# EAGLE schematic tingle (EAGLE 8.3.1)
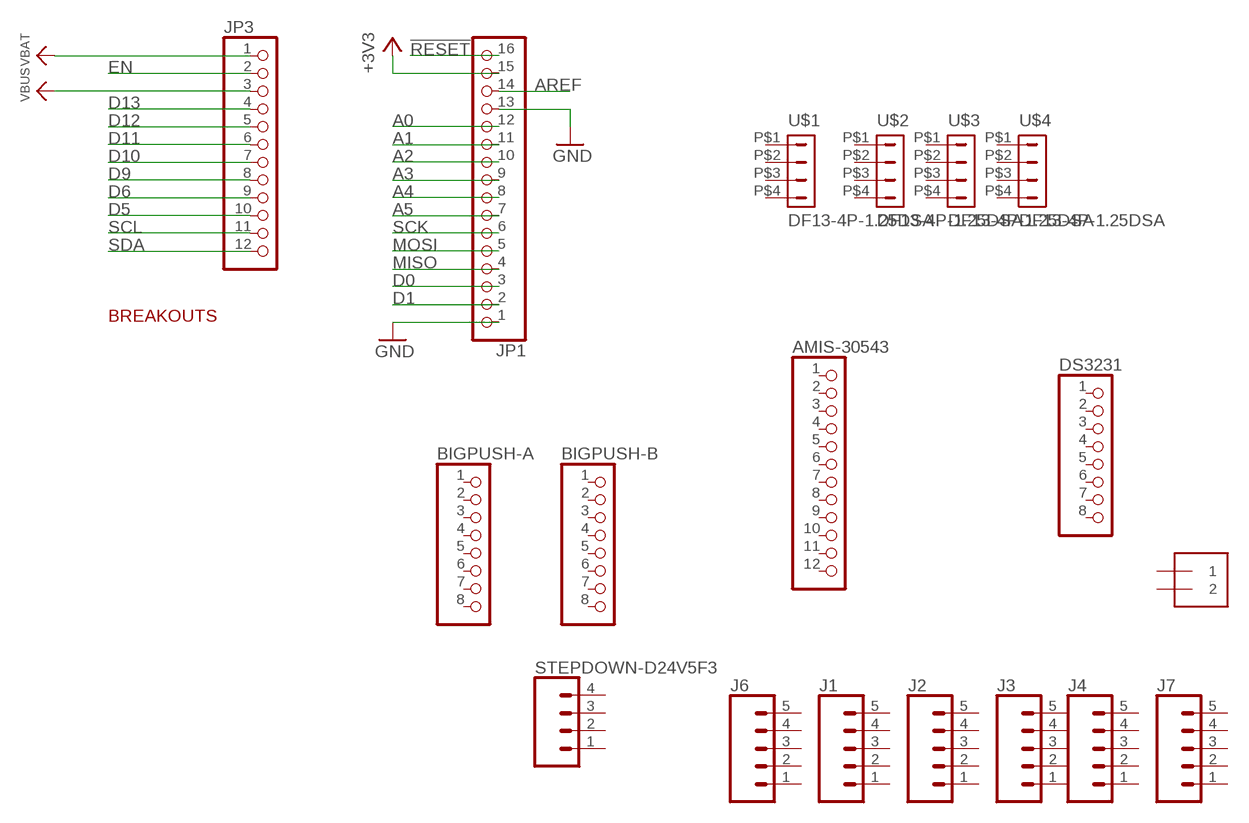
[diagram p0: schematic, sheet 1]

## Parts
AMIS-30543  PINHD-1X12-CB  [1X12-CB]
BIGPUSH-A  PINHD-1X8LOCK  [1X08-LOCK]
BIGPUSH-B  PINHD-1X8LOCK  [1X08-LOCK]
DS3231  PINHD-1X8LOCK  [1X08-LOCK]
J1  CONN_05  [1X05]
J2  CONN_05  [1X05]
J3  CONN_05  [1X05]
J4  CONN_05  [1X05]
J5  1X2-3.5MM  [1X2-3.5MM]
J6  CONN_05  [1X05]
J7  CONN_05  [1X05]
JP1  HEADER-1X16ROUND  [1X16_ROUND]
JP3  HEADER-1X12  [1X12_ROUND]
STEPDOWN-D24V5F3  CONN_04  [1X04]
U$1  DF13-4P-1.25DSA  [DF13-4P-1.25DSA]
U$2  DF13-4P-1.25DSA  [DF13-4P-1.25DSA]
U$3  DF13-4P-1.25DSA  [DF13-4P-1.25DSA]
U$4  DF13-4P-1.25DSA  [DF13-4P-1.25DSA]

## Nets
!RESET: JP1.16
+3V3: JP1.15
A0: JP1.12
A1: JP1.11
A2: JP1.10
A3: JP1.9
A4: JP1.8
A5: JP1.7
AREF: JP1.14
D0: JP1.3
D1: JP1.2
D5: JP3.10
D6: JP3.9
D9: JP3.8
D10: JP3.7
D11: JP3.6
D12: JP3.5
D13: JP3.4
EN: JP3.2
GND: JP1.1 JP1.13
MISO: JP1.4
MOSI: JP1.5
SCK: JP1.6
SCL: JP3.11
SDA: JP3.12
VBAT: JP3.1
VBUS: JP3.3
Unconnected: AMIS-30543.1 AMIS-30543.2 AMIS-30543.3 AMIS-30543.4 AMIS-30543.5 AMIS-30543.6 AMIS-30543.7 AMIS-30543.8 AMIS-30543.9 AMIS-30543.10 AMIS-30543.11 AMIS-30543.12 BIGPUSH-A.1 BIGPUSH-A.2 BIGPUSH-A.3 BIGPUSH-A.4 BIGPUSH-A.5 BIGPUSH-A.6 BIGPUSH-A.7 BIGPUSH-A.8 BIGPUSH-B.1 BIGPUSH-B.2 BIGPUSH-B.3 BIGPUSH-B.4 BIGPUSH-B.5 BIGPUSH-B.6 BIGPUSH-B.7 BIGPUSH-B.8 DS3231.1 DS3231.2 DS3231.3 DS3231.4 DS3231.5 DS3231.6 DS3231.7 DS3231.8 J1.1 J1.2 J1.3 J1.4 J1.5 J2.1 J2.2 J2.3 J2.4 J2.5 J3.1 J3.2 J3.3 J3.4 J3.5 J4.1 J4.2 J4.3 J4.4 J4.5 J5.1 J5.2 J6.1 J6.2 J6.3 J6.4 J6.5 J7.1 J7.2 J7.3 J7.4 J7.5 STEPDOWN-D24V5F3.1 STEPDOWN-D24V5F3.2 STEPDOWN-D24V5F3.3 STEPDOWN-D24V5F3.4 U$1.P$1 U$1.P$2 U$1.P$3 U$1.P$4 U$2.P$1 U$2.P$2 U$2.P$3 U$2.P$4 U$3.P$1 U$3.P$2 U$3.P$3 U$3.P$4 U$4.P$1 U$4.P$2 U$4.P$3 U$4.P$4

## Notes on the sheet
- BREAKOUTS

## Library data of the parts
AMIS-30543 = adafruit:PINHD-1X12: PIN HEADER
BIGPUSH-A BIGPUSH-B DS3231 = adafruit:PINHD-1X8: PIN HEADER
J1-J4 J6 J7 = SparkFun-Connectors:CONN_05: Multi connection point. Often used as Generic Header-pin footprint for 0.1 inch spaced/style header connections On any of the 0.1 inch spaced packages, you can populate with these: Break Away Headers - Straight <https://www.sparkfun.com/products/116> (PRT-00116) Break Away Male Headers - Right Angle <https://www.sparkfun.com/products/553> (PRT-00553) Female Headers <https://www.sparkfun.com/products/115> (PRT-00115) Break Away Headers - Machine Pin <https://www.sparkfun.com/products/117> (PRT-00117) Break Away Female Headers - Swiss Machine Pin <https://www.sparkfun.com/products/743> (PRT-00743) For SCREWTERMINALS and SPRING TERMINALS visit here: Screw Terimnals on SparkFun.com <https://www.sparkfun.com/search/results?term=Screw+Terminals> (5mm/3.5mm/2.54mm spacing) This device is also useful as a general connection point to wire up your design to another part of your project. Our various solder wires solder well into these plated through hole pads. Hook-Up Wire - Assortment (Stranded, 22 AWG) <https://www.sparkfun.com/products/11375> (PRT-11375) Hook-Up Wire - Assortment (Solid Core, 22 AWG) <https://www.sparkfun.com/products/11367> (PRT-11367) View the entire wire category on our website here <https://www.sparkfun.com/categories/141> Special notes: Molex polarized connector foot print use with SKU : PRT-08231 with associated crimp pins and housings. 1MM SMD Version SKU: PRT-10208
J5 = adafruit:1X2: 3.5mm Terminal block http://www.ladyada.net/library/pcb/eaglelibrary.html
JP1 = microbuilder:HEADER-1X16: PIN HEADER
JP3 = microbuilder:HEADER-1X12
STEPDOWN-D24V5F3 = SparkFun-Connectors:CONN_04: Multi connection point. Often used as Generic Header-pin footprint for 0.1 inch spaced/style header connections On any of the 0.1 inch spaced packages, you can populate with these: Break Away Headers - Straight <https://www.sparkfun.com/products/116> (PRT-00116) Break Away Male Headers - Right Angle <https://www.sparkfun.com/products/553> (PRT-00553) Female Headers <https://www.sparkfun.com/products/115> (PRT-00115) Break Away Headers - Machine Pin <https://www.sparkfun.com/products/117> (PRT-00117) Break Away Female Headers - Swiss Machine Pin <https://www.sparkfun.com/products/743> (PRT-00743) For SCREWTERMINALS and SPRING TERMINALS visit here: Screw Terimnals on SparkFun.com <https://www.sparkfun.com/search/results?term=Screw+Terminals> (5mm/3.5mm/2.54mm spacing) This device is also useful as a general connection point to wire up your design to another part of your project. Our various solder wires solder well into these plated through hole pads. Hook-Up Wire - Assortment (Stranded, 22 AWG) <https://www.sparkfun.com/products/11375> (PRT-11375) Hook-Up Wire - Assortment (Solid Core, 22 AWG) <https://www.sparkfun.com/products/11367> (PRT-11367) View the entire wire category on our website here <https://www.sparkfun.com/categories/141> Special notes: Molex polarized connector foot print use with SKU : PRT-08231 with associated crimp pins and housings. 1MM SMD Version SKU: PRT-10208; PROD_ID: CONN-09696
U$1-U$4 = con-hirose-df13:DF13-4P-1.25: DF13-4P 1.25mm Pitch Miniature Crimping Connector.